# Altium schematic sheet USB_OTG.SchDoc: USB_OTG_HS
size A4; DocumentNumber: MB1219; Revision: B.1; SheetNumber: 8; SheetTotal: 17; Project: STM32F769I-EVAL
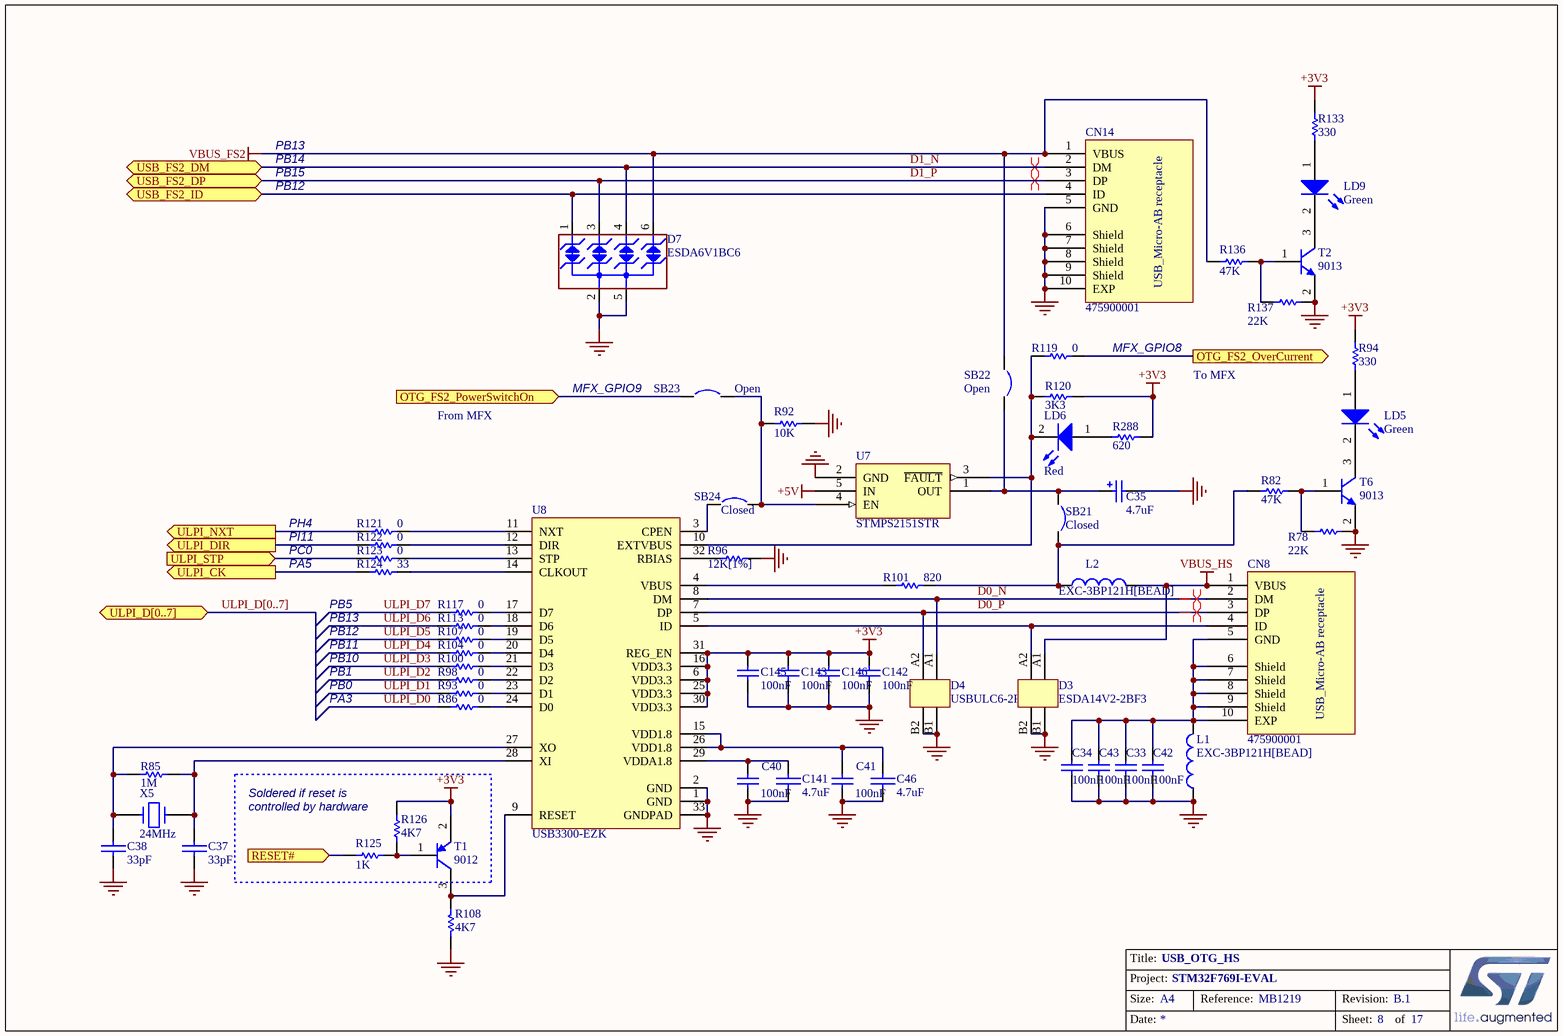
[diagram p0: USB_OTG.SchDoc]

## Parts
C33  100nF  [0603C]
C34  100nF  [0603C]
C35  4.7uF  [TAN-A]
C37  33pF  [0603C]
C38  33pF  [0603C]
C40  100nF  [0603C]
C41  100nF  [0603C]
C42  100nF  [0603C]
C43  100nF  [0603C]
C46  4.7uF  [TAN-A]
C141  4.7uF  [TAN-A]
C142  100nF  [0603C]
C143  100nF  [0603C]
C145  100nF  [0603C]
C146  100nF  [0603C]
CN8  475900001  [MOLEX_47590001]
CN14  475900001  [MOLEX_47590001]
D3  ESDA14V2-2BF3  [BGA4_0R4_0R8X0R8]
D4  USBULC6-2F3  [BGA4_0R4_1X1]
D7  ESDA6V1BC6  [SOT23-6]
L1  EXC-3BP121H[BEAD]  [0603L]
L2  EXC-3BP121H[BEAD]  [0603L]
LD5  Green  [0603D]
LD6  Red  [0603D]
LD9  Green  [0603D]
R78  22K  [0603R]
R82  47K  [0603R]
R85  1M  [0603R]
R86  0  [0603R]
R92  10K  [0603R]
R93  0  [0603R]
R94  330  [0603R]
R96  12K[1%]  [0603R]
R98  0  [0603R]
R100  0  [0603R]
R101  820  [0603R]
R104  0  [0603R]
R107  0  [0603R]
R108  4K7  [0603R]
R113  0  [0603R]
R117  0  [0603R]
R119  0  [0603R]
R120  3K3  [0603R]
R121  0  [0603R]
R122  0  [0603R]
R123  0  [0603R]
R124  33  [0603R]
R125  1K  [0603R]
R126  4K7  [0603R]
R133  330  [0603R]
R136  47K  [0603R]
R137  22K  [0603R]
R288  620  [0603R]
SB21  Closed  [SB_0603]
SB22  Open  [SB_0603]
SB23  Open  [SB_0603]
SB24  Closed  [SB_0603]
T1  9012  [SOT-23]
T2  9013  [SOT-23]
T6  9013  [SOT-23]
U7  STMPS2151STR  [SOT23-5]
U8  USB3300-EZK  [QFN32_0R5_5X5]
X5  24MHz  [XTAL1]

## Ports
OTG_FS2_OverCurrent (out), OTG_FS2_PowerSwitchOn (in), RESET# (in), ULPI_CK (out), ULPI_D[0..7] (bidir), ULPI_DIR (out), ULPI_NXT (out), ULPI_STP (in), USB_FS2_DM (bidir), USB_FS2_DP (bidir), USB_FS2_ID (bidir)

## Nets
+3V3: C142.1 C143.1 C145.1 C146.1 R94.2 R120.1 R126.1 R133.2 R288.2 T1.2(E) U8.6(VDD3.3) U8.16(VDD3.3) U8.25(VDD3.3) U8.30(VDD3.3) U8.31(REG_EN)
+5V: U7.5(IN)
GND: C33.2 C34.2 C35.2 C37.2 C38.2 C40.2 C41.2 C42.2 C43.2 C46.2 C141.2 C142.2 C143.2 C145.2 C146.2 CN14.5(GND) CN14.6(Shield) CN14.7(Shield) CN14.8(Shield) CN14.9(Shield) CN14.10(EXP) D3.B1 D3.B2 D4.B1 D4.B2 D7.2(IO2) D7.5(IO4) L1.1 R78.1 R92.1 R96.1 R108.1 R137.1 T2.2(E) T6.2(E) U7.2(GND) U8.1(GND) U8.2(GND) U8.33(GNDPAD)
VBUS_FS2: CN14.1(VBUS) D7.6(NC) R136.1 SB22.1
VBUS_HS: CN8.1(VBUS) D3.A1 L2.2
D0_N: CN8.2(DM) D4.A1 U8.8(DM)
D0_P: CN8.3(DP) D4.A2 U8.7(DP)
D1_N: CN14.2(DM) D7.4(IO3) ; port USB_FS2_DM
D1_P: CN14.3(DP) D7.3(GND) ; port USB_FS2_DP
OTG_FS2_OverCurrent: R119.1 ; port OTG_FS2_OverCurrent
OTG_FS2_PowerSwitchOn: SB23.1 ; port OTG_FS2_PowerSwitchOn
RESET#: R125.2 ; port RESET#
ULPI_CK: R124.2 ; port ULPI_CK
ULPI_D0: R86.2
ULPI_D1: R93.2
ULPI_D2: R98.2
ULPI_D3: R100.2
ULPI_D4: R104.2
ULPI_D5: R107.2
ULPI_D6: R113.2
ULPI_D7: R117.2
ULPI_DIR: R122.2 ; port ULPI_DIR
ULPI_NXT: R121.2 ; port ULPI_NXT
ULPI_STP: R123.2 ; port ULPI_STP
USB_FS2_ID: CN14.4(ID) D7.1(IO1) ; port USB_FS2_ID
NetC33_1: C33.1 C34.1 C42.1 C43.1 CN8.5(GND) CN8.6(Shield) CN8.7(Shield) CN8.8(Shield) CN8.9(Shield) CN8.10(EXP) L1.2
NetC35_1: C35.1 SB21.1 SB22.2 U7.1(OUT)
NetC37_1: C37.1 R85.2 U8.28(XI) X5.1
NetC38_1: C38.1 R85.1 U8.27(XO) X5.2
NetC40_1: C40.1 C141.1 U8.29(VDDA1.8)
NetC41_1: C41.1 C46.1 U8.15(VDD1.8) U8.26(VDD1.8)
NetCN8_4: CN8.4(ID) D3.A2 U8.5(ID)
NetL2_1: L2.1 R82.2 R101.2 SB21.2
NetLD5_1: LD5.1(A) R94.1
NetLD5_2: LD5.2(K) T6.3(C)
NetLD6_1: LD6.1(A) R288.1
NetLD6_2: LD6.2(K) R119.2 R120.2 U7.3(~{FAULT}) U8.10(EXTVBUS)
NetLD9_1: LD9.1(A) R133.1
NetLD9_2: LD9.2(K) T2.3(C)
NetR78_2: R78.2 R82.1 T6.1(B)
NetR86_1: R86.1 U8.24(D0)
NetR92_2: R92.2 SB23.2 SB24.2 U7.4(EN)
NetR93_1: R93.1 U8.23(D1)
NetR96_2: R96.2 U8.32(RBIAS)
NetR98_1: R98.1 U8.22(D2)
NetR100_1: R100.1 U8.21(D3)
NetR101_1: R101.1 U8.4(VBUS)
NetR104_1: R104.1 U8.20(D4)
NetR107_1: R107.1 U8.19(D5)
NetR108_2: R108.2 T1.3(C) U8.9(RESET)
NetR113_1: R113.1 U8.18(D6)
NetR117_1: R117.1 U8.17(D7)
NetR121_1: R121.1 U8.11(NXT)
NetR122_1: R122.1 U8.12(DIR)
NetR123_1: R123.1 U8.13(STP)
NetR124_1: R124.1 U8.14(CLKOUT)
NetR125_1: R125.1 R126.2 T1.1(B)
NetR136_2: R136.2 R137.2 T2.1(B)
NetSB24_1: SB24.1 U8.3(CPEN)

## Buses and harness runs
bus ULPI_D[0..7] = port ULPI_D[0..7]

## Layout directives
differential pair: D0_N, D0_P, D1_N, D1_P

## Notes on the sheet
- PB13
- PB14
- PB15
- PB12
- MFX_GPIO8
- To MFX
- From MFX
- MFX_GPIO9
- PH4
- PI11
- PC0
- PA5
- PB11
- PB5
- PA3
- PB0
- PB1
- PB10
- (near R126) Soldered if reset is
- (near R126) controlled by hardware
- Title:
- Project:
- Size:
- Date:
- A4
- Reference:
- Sheet:
- Revision:
- of
- (in symbol 475900001) USB_Micro-AB receptacle

## Library data of the parts
C33 C34 C40-C43 C142 C143 C145 C146 = Cap: Capacitor; Value: 10nF; Published: 8-Jun-2000; Revision: July-2002: Re-released for DXP Platform.; Publisher: Altium Limited
C35 = Cap Pol1: Polarized Capacitor (Radial); Value: 47uF; Published: 8-Jun-2000; Revision: July-2002: Re-released for DXP Platform.; Publisher: Altium Limited
C37 C38 C46 C141 = CAP: Capacitor
D7 = ESDA6V1BC6: 4-line ESD protection; Manuf_1: STM; Manuf_Part_1: ESDA5V3L; Description: Dual Transil array for ESD protection; Ref St: 9179034; Provided: ST; ECCN_US/EU: EAR99/NEC; Distrib: ST; Order: ESDA5V3L; Ordered by: STM
L1 L2 = Inductor: Value: 100uH; Published: 8-Jun-2000; Revision: July-2002: Re-released for DXP Platform.; Publisher: Altium Limited
LD5 LD6 LD9 = LED2: Typical RED, GREEN, YELLOW, AMBER GaAs LED; Published: 8-Jun-2000; Revision: July-2002: Re-released for DXP Platform.; Publisher: Altium Limited
R78 R82 R92 R94 R101 R120 R133 R136 R137 = res1: Resistor; Value: 1K; Published: 8-Jun-2000; Revision: July-2002: Re-released for DXP Platform.; Publisher: Altium Limited
R85 R86 R93 R96 R98 R100 R104 R107 R108 R113 R117 R119 R121-R124 R126 R288 = Res1: Resistor; Value: 1K; Published: 8-Jun-2000; Revision: July-2002: Re-released for DXP Platform.; Publisher: Altium Limited
R125 = Res1: Resistor; Published: 8-Jun-2000; Revision: July-2002: Re-released for DXP Platform.; Publisher: Altium Limited; Value: 1K
SB21 SB24 = Circuit Breaker_close: Circuit Breaker; Published: 24-Mar-1999; Revision: July-2002: Re-released for DXP Platform.; Publisher: Altium Limited
SB22 SB23 = Circuit Breaker: Published: 24-Mar-1999; Revision: July-2002: Re-released for DXP Platform.; Publisher: Altium Limited
T1 = PNP: PNP Bipolar Transistor; Published: 8-Jun-2000; Revision: July-2002: Re-released for DXP Platform.; Publisher: Altium Limited; Code - JEDEC: SOT-23
T2 T6 = NPN: NPN Bipolar Transistor; Code - JEDEC: TO-226-AA; Published: 8-Jun-2000; Revision: July-2002: Re-released for DXP Platform.; Publisher: Altium Limited
U7 = STMPS2141STR
X5 = CRYSTAL